# Altium schematic sheet Outgoing_connectors_1_to_3.SchDoc
size A4
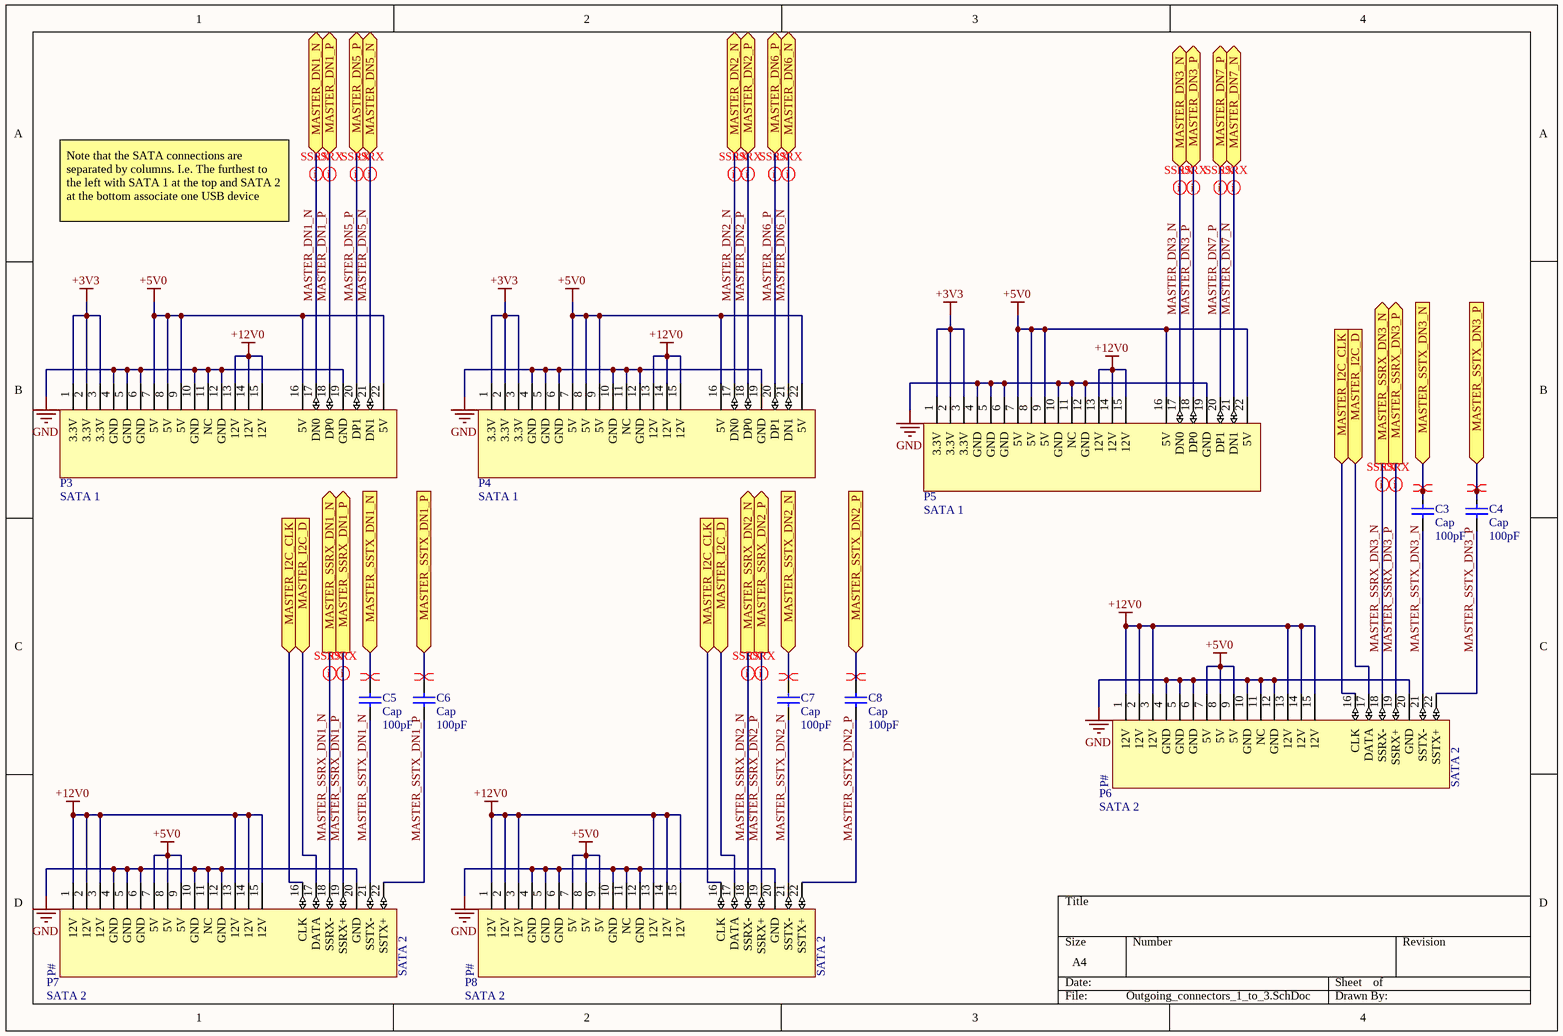
[diagram p0: Outgoing_connectors_1_to_3.SchDoc]

## Parts
C3  Cap  value 100pF  [RAD-0.3]
C4  Cap  value 100pF  [RAD-0.3]
C5  Cap  value 100pF  [RAD-0.3]
C6  Cap  value 100pF  [RAD-0.3]
C7  Cap  value 100pF  [RAD-0.3]
C8  Cap  value 100pF  [RAD-0.3]
P3  SATA 1  [Amphenol 10017660-001LF]
P4  SATA 1  [Amphenol 10017660-001LF]
P5  SATA 1  [Amphenol 10017660-001LF]
P6  SATA 2  [Amphenol 10017660-001LF]
P7  SATA 2  [Amphenol 10017660-001LF]
P8  SATA 2  [Amphenol 10017660-001LF]

## Ports
MASTER_DN1_N (bidir), MASTER_DN1_P (bidir), MASTER_DN2_N (bidir), MASTER_DN2_P (bidir), MASTER_DN3_N (bidir), MASTER_DN3_P (bidir), MASTER_DN5_N (bidir), MASTER_DN5_P (bidir), MASTER_DN6_N (bidir), MASTER_DN6_P (bidir), MASTER_DN7_N (bidir), MASTER_DN7_P (bidir), MASTER_I2C_CLK (in), MASTER_I2C_D (in), MASTER_SSRX_DN1_N (out), MASTER_SSRX_DN1_P (out), MASTER_SSRX_DN2_N (out), MASTER_SSRX_DN2_P (out), MASTER_SSRX_DN3_N (out), MASTER_SSRX_DN3_P (out), MASTER_SSTX_DN1_N (in), MASTER_SSTX_DN1_P (in), MASTER_SSTX_DN2_N (in), MASTER_SSTX_DN2_P (in), MASTER_SSTX_DN3_N (in), MASTER_SSTX_DN3_P (in)

## Nets
+3V3: P3.1(3.3V) P3.2(3.3V) P3.3(3.3V) P4.1(3.3V) P4.2(3.3V) P4.3(3.3V) P5.1(3.3V) P5.2(3.3V) P5.3(3.3V)
+5V0: P3.7(5V) P3.8(5V) P3.9(5V) P3.16(5V) P3.22(5V) P4.7(5V) P4.8(5V) P4.9(5V) P4.16(5V) P4.22(5V) P5.7(5V) P5.8(5V) P5.9(5V) P5.16(5V) P5.22(5V) P6.7(5V) P6.8(5V) P6.9(5V) P7.7(5V) P7.8(5V) P7.9(5V) P8.7(5V) P8.8(5V) P8.9(5V)
+12V0: P3.13(12V) P3.14(12V) P3.15(12V) P4.13(12V) P4.14(12V) P4.15(12V) P5.13(12V) P5.14(12V) P5.15(12V) P6.1(12V) P6.2(12V) P6.3(12V) P6.13(12V) P6.14(12V) P6.15(12V) P7.1(12V) P7.2(12V) P7.3(12V) P7.13(12V) P7.14(12V) P7.15(12V) P8.1(12V) P8.2(12V) P8.3(12V) P8.13(12V) P8.14(12V) P8.15(12V)
GND: P3.4(GND) P3.5(GND) P3.6(GND) P3.10(GND) P3.11(NC) P3.12(GND) P3.19(GND) P4.4(GND) P4.5(GND) P4.6(GND) P4.10(GND) P4.11(NC) P4.12(GND) P4.19(GND) P5.4(GND) P5.5(GND) P5.6(GND) P5.10(GND) P5.11(NC) P5.12(GND) P5.19(GND) P6.4(GND) P6.5(GND) P6.6(GND) P6.10(GND) P6.11(NC) P6.12(GND) P6.20(GND) P7.4(GND) P7.5(GND) P7.6(GND) P7.10(GND) P7.11(NC) P7.12(GND) P7.20(GND) P8.4(GND) P8.5(GND) P8.6(GND) P8.10(GND) P8.11(NC) P8.12(GND) P8.20(GND)
MASTER_DN1_N: P3.17(DN0) ; port MASTER_DN1_N
MASTER_DN1_P: P3.18(DP0) ; port MASTER_DN1_P
MASTER_DN2_N: P4.17(DN0) ; port MASTER_DN2_N
MASTER_DN2_P: P4.18(DP0) ; port MASTER_DN2_P
MASTER_DN3_N: P5.17(DN0) ; port MASTER_DN3_N
MASTER_DN3_P: P5.18(DP0) ; port MASTER_DN3_P
MASTER_DN5_N: P3.21(DN1) ; port MASTER_DN5_N
MASTER_DN5_P: P3.20(DP1) ; port MASTER_DN5_P
MASTER_DN6_N: P4.21(DN1) ; port MASTER_DN6_N
MASTER_DN6_P: P4.20(DP1) ; port MASTER_DN6_P
MASTER_DN7_N: P5.21(DN1) ; port MASTER_DN7_N
MASTER_DN7_P: P5.20(DP1) ; port MASTER_DN7_P
MASTER_I2C_CLK: P6.16(CLK) P7.16(CLK) P8.16(CLK) ; port MASTER_I2C_CLK
MASTER_I2C_D: P6.17(DATA) P7.17(DATA) P8.17(DATA) ; port MASTER_I2C_D
MASTER_SSRX_DN1_N: P7.18(SSRX-) ; port MASTER_SSRX_DN1_N
MASTER_SSRX_DN1_P: P7.19(SSRX+) ; port MASTER_SSRX_DN1_P
MASTER_SSRX_DN2_N: P8.18(SSRX-) ; port MASTER_SSRX_DN2_N
MASTER_SSRX_DN2_P: P8.19(SSRX+) ; port MASTER_SSRX_DN2_P
MASTER_SSRX_DN3_N: P6.18(SSRX-) ; port MASTER_SSRX_DN3_N
MASTER_SSRX_DN3_P: P6.19(SSRX+) ; port MASTER_SSRX_DN3_P
MASTER_SSTX_DN1_N: C5.1 P7.21(SSTX-)
MASTER_SSTX_DN1_N: C5.2 ; port MASTER_SSTX_DN1_N  [a separate net that carries the same name]
MASTER_SSTX_DN1_P: C6.1 P7.22(SSTX+)
MASTER_SSTX_DN1_P: C6.2 ; port MASTER_SSTX_DN1_P  [a separate net that carries the same name]
MASTER_SSTX_DN2_N: C7.1 P8.21(SSTX-)
MASTER_SSTX_DN2_N: C7.2 ; port MASTER_SSTX_DN2_N  [a separate net that carries the same name]
MASTER_SSTX_DN2_P: C8.1 P8.22(SSTX+)
MASTER_SSTX_DN2_P: C8.2 ; port MASTER_SSTX_DN2_P  [a separate net that carries the same name]
MASTER_SSTX_DN3_N: C3.1 P6.21(SSTX-)
MASTER_SSTX_DN3_N: C3.2 ; port MASTER_SSTX_DN3_N  [a separate net that carries the same name]
MASTER_SSTX_DN3_P: C4.1 P6.22(SSTX+)
MASTER_SSTX_DN3_P: C4.2 ; port MASTER_SSTX_DN3_P  [a separate net that carries the same name]

## Layout directives
differential pair; rule Signal Stimulus [Kind - Single Pulse    Level - High    Start Time = 0.000    Stop Time = 200.0p    Period Time = 400.0p]: (no net found under the mark), MASTER_DN1_N, MASTER_DN1_P, MASTER_DN2_N, MASTER_DN2_P, MASTER_DN3_N, MASTER_DN3_P, MASTER_DN5_N, MASTER_DN5_P, MASTER_DN6_N, MASTER_DN6_P, MASTER_DN7_N, MASTER_DN7_P, MASTER_SSRX_DN1_N, MASTER_SSRX_DN1_P, MASTER_SSRX_DN2_N, MASTER_SSRX_DN2_P, MASTER_SSRX_DN3_N, MASTER_SSRX_DN3_P

## Notes on the sheet
- Note that the SATA connections are separated by columns. I.e. The furthest to the left with SATA 1 at the top and SATA 2 at the bottom associate one USB device
- (in symbol SATA 2) P#

## Library data of the parts
C3-C8 = Cap: Capacitor; Published: 8-Jun-2000; LatestRevisionDate: 17-Jul-2002; LatestRevisionNote: Re-released for DXP Platform.; PackageReference: RAD-0.3; Publisher: Altium Limited; PackageDescription: Radial Cap, Thru-Hole; 2 Leads; 0.3 in Pin Spacing
P3-P5 = SATA 1: SATA connector. / Connector 1 for option 1 as per Spec; Supplier 1: Digi-Key
P6-P8 = SATA 2: SATA connector. / Connector 2 for option 1 as per Spec; Supplier 1: Digi-Key